# Altium schematic sheet MainSheet.SchDoc
size A4; Date: -; ApprovedBy: -; CheckedBy: h.t.t.monfared; Author: h.t.t.monfared; CompanyName: -; Engineer: h.t.t.monfared; Organization: -; Revision: 1.0; SheetNumber: 1; SheetTotal: 9; Project Code:: UFM Sensor Controller; Document Title:: Main Sheet; ImagePath: -
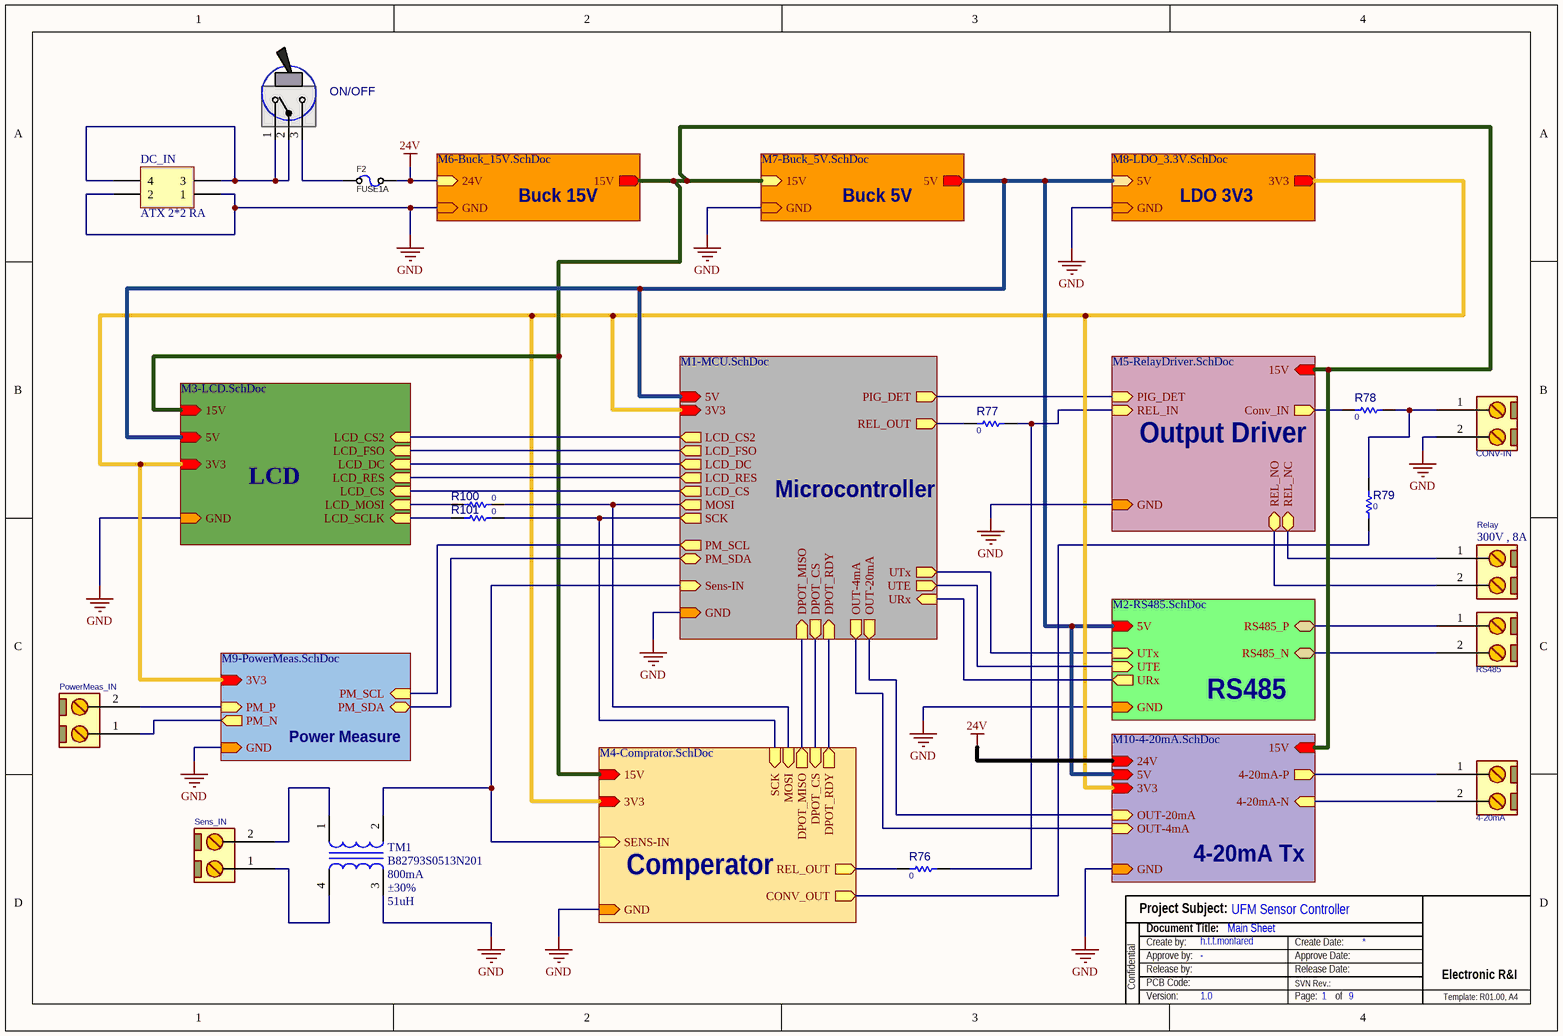
[diagram p0: MainSheet.SchDoc]

## Parts
4-20mA  Output  [MSTB_2]  (value not drawn)
CONV-IN  Output  [MSTB_2]  (value not drawn)
DC_IN  ATX 2*2 RA  [POWER_2X2-RA]
F2  FUSE1A  [F2410]
ON/OFF  ToggleSwitch  [SWTOG_SPDT_R_M2012]  (value not drawn)
PowerMeas_IN  (no value)  [MSTB_2]
R76  0  [R1206]
R77  0  [R1206]
R78  0  [R1206]
R79  0  [R1206]
R100  0  [R1206]
R101  0  [R1206]
Relay  300V , 8A  [MSTB_2]
RS485  Output  [MSTB_2]  (value not drawn)
Sens_IN  (no value)  [MSTB_2]
TM1  B82793S0513N201  value 51uH  Current-Rated: 800mA  Tolerance: ±30%  [Choke-7.1_6.0_4.8]

## Sub-sheets
4-20mA Tx = M10-4-20mA.SchDoc: 4-20mA-N (in), 4-20mA-P (out), 3V3 (in), GND (in), OUT-20mA (in), OUT-4mA (in), 15V (in), 24V (in), 5V (in)
Buck 5V = M7-Buck_5V.SchDoc: 15V (in), GND (in), 5V (out)
Buck 15V = M6-Buck_15V.SchDoc: 24V (in), GND (in), 15V (out)
Comperator = M4-Comprator.SchDoc: 15V (in), SENS-IN (in), GND (in), CONV_OUT (out), 3V3 (in), DPOT_CS (in), DPOT_MISO (out), DPOT_RDY (out), REL_OUT (out), SCK (in), MOSI (in)
LCD = M3-LCD.SchDoc: 3V3 (in), GND (in), LCD_MOSI (in), LCD_SCLK (in), 15V (in), 5V (in), LCD_CS (in), LCD_FSO (in), LCD_DC (in), LCD_RES (in), LCD_CS2 (in)
LDO 3V3 = M8-LDO_3.3V.SchDoc: 5V (in), GND (in), 3V3 (out)
Microcontroller = M1-MCU.SchDoc: 3V3 (in), GND (in), Sens-IN (in), UTE (out), UTx (out), URx (in), PIG_DET (out), REL_OUT (out), DPOT_CS (out), DPOT_RDY (in), PM_SDA (bidir), PM_SCL (out), 5V (in), LCD_RES (out), MOSI (out), LCD_CS2 (out), LCD_FSO (out), LCD_DC (out), LCD_CS (out), SCK (out), DPOT_MISO (in), OUT-20mA (out), OUT-4mA (out)
Output Driver = M5-RelayDriver.SchDoc: 15V (in), PIG_DET (in), GND (in), Conv_IN (out), REL_NO (bidir), REL_NC (bidir), REL_IN (in)
Power Measure = M9-PowerMeas.SchDoc: PM_SDA (bidir), 3V3 (in), GND (in), PM_P (in), PM_N (out), PM_SCL (in)
RS485 = M2-RS485.SchDoc: 5V (in), GND (in), RS485_P (bidir), RS485_N (bidir), URx (out), UTx (in), UTE (in)

## Nets
24V: F2.2 ; sheet Buck 15V/24V, sheet 4-20mA Tx/24V
GND: CONV-IN.2 DC_IN.1 DC_IN.2 TM1.3 ; sheet Microcontroller/GND, sheet Buck 15V/GND, sheet Buck 5V/GND, sheet LDO 3V3/GND, sheet Output Driver/GND, sheet LCD/GND, sheet RS485/GND, sheet Comperator/GND, sheet Power Measure/GND, sheet 4-20mA Tx/GND
Net4-20mA_1: 4-20mA.1 ; sheet 4-20mA Tx/4-20mA-P
Net4-20mA_2: 4-20mA.2 ; sheet 4-20mA Tx/4-20mA-N
NetCONV-IN_1: CONV-IN.1 R78.2 R79.2
NetDC_IN_3: DC_IN.3 DC_IN.4 ON/OFF.1(T1) ON/OFF.2(COM)
NetF2_1: F2.1 ON/OFF.3(T2)
NetPowerMeas_IN_1: PowerMeas_IN.1 ; sheet Power Measure/PM_N
NetPowerMeas_IN_2: PowerMeas_IN.2 ; sheet Power Measure/PM_P
NetR76_1: R76.1 ; sheet Comperator/REL_OUT
NetR76_2: R76.2 R77.2 ; sheet Output Driver/REL_IN
NetR77_1: R77.1 ; sheet Microcontroller/REL_OUT
NetR78_1: R78.1 ; sheet Output Driver/Conv_IN
NetR79_1: R79.1 ; sheet Comperator/CONV_OUT
NetR100_1: R100.1 ; sheet LCD/LCD_MOSI
NetR100_2: R100.2 ; sheet Microcontroller/MOSI, sheet Comperator/MOSI
NetR101_1: R101.1 ; sheet LCD/LCD_SCLK
NetR101_2: R101.2 ; sheet Microcontroller/SCK, sheet Comperator/SCK
NetRelay_1: Relay.1 ; sheet Output Driver/REL_NC
NetRelay_2: Relay.2 ; sheet Output Driver/REL_NO
NetRS485_1: RS485.1 ; sheet RS485/RS485_P
NetRS485_2: RS485.2 ; sheet RS485/RS485_N
NetSens_IN_1: Sens_IN.1 TM1.4
NetSens_IN_2: Sens_IN.2 TM1.1
NetTM1_2: TM1.2 ; sheet Microcontroller/Sens-IN, sheet Comperator/SENS-IN
(unnamed): sheet Microcontroller/3V3, sheet LDO 3V3/3V3, sheet LCD/3V3, sheet Comperator/3V3, sheet Power Measure/3V3, sheet 4-20mA Tx/3V3
(unnamed): sheet Microcontroller/UTE, sheet RS485/UTE
(unnamed): sheet Microcontroller/UTx, sheet RS485/UTx
(unnamed): sheet Microcontroller/URx, sheet RS485/URx
(unnamed): sheet Microcontroller/PIG_DET, sheet Output Driver/PIG_DET
(unnamed): sheet Microcontroller/DPOT_CS, sheet Comperator/DPOT_CS
(unnamed): sheet Microcontroller/DPOT_RDY, sheet Comperator/DPOT_RDY
(unnamed): sheet Microcontroller/PM_SDA, sheet Power Measure/PM_SDA
(unnamed): sheet Microcontroller/PM_SCL, sheet Power Measure/PM_SCL
(unnamed): sheet Microcontroller/5V, sheet Buck 5V/5V, sheet LDO 3V3/5V, sheet LCD/5V, sheet RS485/5V, sheet 4-20mA Tx/5V
(unnamed): sheet Microcontroller/LCD_RES, sheet LCD/LCD_RES
(unnamed): sheet Microcontroller/LCD_CS2, sheet LCD/LCD_CS2
(unnamed): sheet Microcontroller/LCD_FSO, sheet LCD/LCD_FSO
(unnamed): sheet Microcontroller/LCD_DC, sheet LCD/LCD_DC
(unnamed): sheet Microcontroller/LCD_CS, sheet LCD/LCD_CS
(unnamed): sheet Microcontroller/DPOT_MISO, sheet Comperator/DPOT_MISO
(unnamed): sheet Microcontroller/OUT-20mA, sheet 4-20mA Tx/OUT-20mA
(unnamed): sheet Microcontroller/OUT-4mA, sheet 4-20mA Tx/OUT-4mA
(unnamed): sheet Buck 15V/15V, sheet Buck 5V/15V, sheet Output Driver/15V, sheet LCD/15V, sheet Comperator/15V, sheet 4-20mA Tx/15V

## Notes on the sheet
- Project Subject:
- Confidential
- Release by:
- Document Title:
- Create by:
- PCB Code:
- Approve by:
- SVN Rev.:
- Create Date:
- Release Date:
- Approve Date:
- Electronic R&I
- Version:
- Page:
- of
- Template: R01.00, A4

## Library data of the parts
4-20mA CONV-IN PowerMeas_IN Relay RS485 Sens_IN = CONN_MSTB_2: CONN, PHOENIX MSTB, 5-G, 5.08mm pitch; PARAM2: 320V; PARAM: 12A
  4-20mA CONV-IN RS485: VALUE: Output
  Relay: VALUE: 300V , 8A
DC_IN = Header 2X2: Header, 2-Pin, Dual row; LatestRevisionDate: 17-Jul-2002; LatestRevisionNote: Re-released for DXP Platform.; Publisher: Altium Limited
F2 = FUSE_1A_2410: Fuse, 1A, 125VDC, 2410, SMD, Fast Acting; PARAM: 1A; 125VDC; fast acting; MANF: Reomax; MANF_P#: SFE1100; PARAM2: 0.25 Ohm DC Cold Resistance; PRICE: 260toman@Javan; VALUE: FUSE1A
ON/OFF = SWTOG_SPDT_R_M2012: SWITCH, TOGGLE, SPDT, THD; MANF_PART#: M2012SA2W30; MANF: NKK; PARAM: 3A, 125VAC/30VDC; DESC: DESCRIPTION; VALUE: ToggleSwitch; ASSEMBLY: ASSEMBLY; PRICE: 3.5$
R76-R79 R100 R101 = RES_SMD: RESISTOR, SMD; PARAM: -W; DESC: DESCRIPTION; DIST#: MOUSER; PARAM2: 1%; MANF_P#: -; MANF: -; ASSEMBLY: ASSEMBLY; PRICE: 100= 0.5$; VALUE: 0
TM1 = ME90902601: Inductor,S,Choke,Ferrite,800mA,30%,7.1x6x4.8mm; Manufacturer Code1: 0000101476; Manufacturer Name1: TDK Europe GmbH; Unit Price (USD): Coming Soon; Alternative: Please Add; Description Farsi: سلف،S،Choke،800mA،30%،7.1x6x4.8mm; Resistance-DC (Rdc): 0.14(Ohm); Automotive Qualified: AEC-Q200; Frequency-Test-Q: NA; Packing: TAPE AND REEL; Frequency-Test-L: 100KHz; Voltage-Rated: 80V; Material: ME90902601; Function in Circuit: Please Add; Material Class: Inductor; Type: Choke; Lead Free: YES; Frequency-Self Resonant (SRF): NA; ComponentLink1URL: \\192.168.5.63\eRI_ComponentDatabase\Datasheets\SAP\DSH_2025891_00_1.PDF; Termination Style (SMD/THT): SMD; Manufacturer PN1: B82793S0513N201; Quality Factor (Q): NA; ComponentLink1Description: DSH2025891RE: Datasheet-TDK; RoHS: YES; Size (LxWxH)/(DxH): L7.1xW6xH4.8mm